# Altium schematic sheet [04] - REVISION HISTORY.SchDoc
size A4; DocumentNumber: 4; SheetNumber: 4; SheetTotal: 5
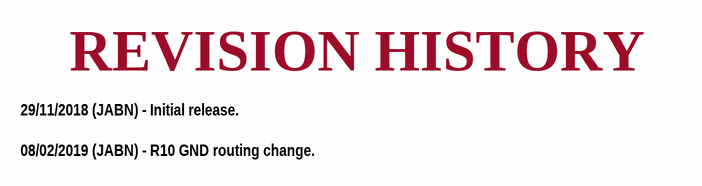
[diagram p0: [04] - REVISION HISTORY.SchDoc]

## Notes on the sheet
- 29/11/2018 (JABN) - Initial release.
- REVISION HISTORY
- 08/02/2019 (JABN) - R10 GND routing change.
- Project:
- Page Contents:
- Size:
- Revision:
- A4
- Document Number:
- Design:
- Date:
- Sheet
- of